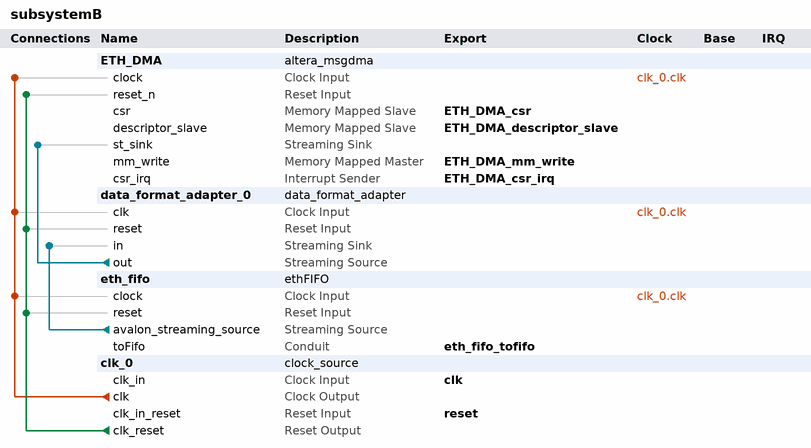
[diagram p0: system contents]
# Platform Designer (Qsys) system subsystemB, Stratix IV EP4SGX230KF40C2
# Parameters at their usual value, and those the tool derives, are not listed.
package require -exact qsys 18.1
create_system subsystemB
set_project_property DEVICE_FAMILY {Stratix IV}
set_project_property DEVICE EP4SGX230KF40C2

add_instance ETH_DMA altera_msgdma 18.1
set_instance_parameter_value ETH_DMA BURST_ENABLE 0
set_instance_parameter_value ETH_DMA DATA_FIFO_DEPTH 64
set_instance_parameter_value ETH_DMA DATA_WIDTH 256
set_instance_parameter_value ETH_DMA DESCRIPTOR_FIFO_DEPTH 128
set_instance_parameter_value ETH_DMA ENHANCED_FEATURES 0
set_instance_parameter_value ETH_DMA ERROR_ENABLE 0
set_instance_parameter_value ETH_DMA MAX_BURST_COUNT 2
set_instance_parameter_value ETH_DMA MAX_BYTE 2048
set_instance_parameter_value ETH_DMA MODE 2
set_instance_parameter_value ETH_DMA PACKET_ENABLE 1
set_instance_parameter_value ETH_DMA TRANSFER_TYPE {Aligned Accesses}

add_instance data_format_adapter_0 data_format_adapter 18.1
set_instance_parameter_value data_format_adapter_0 inBitsPerSymbol 8
set_instance_parameter_value data_format_adapter_0 inChannelWidth 0
set_instance_parameter_value data_format_adapter_0 inErrorWidth 0
set_instance_parameter_value data_format_adapter_0 inMaxChannel 0
set_instance_parameter_value data_format_adapter_0 inReadyLatency 0
set_instance_parameter_value data_format_adapter_0 inSymbolsPerBeat 8
set_instance_parameter_value data_format_adapter_0 inUseEmpty false
set_instance_parameter_value data_format_adapter_0 inUseEmptyPort AUTO
set_instance_parameter_value data_format_adapter_0 inUsePackets true
set_instance_parameter_value data_format_adapter_0 outSymbolsPerBeat 32
set_instance_parameter_value data_format_adapter_0 outUseEmpty false
set_instance_parameter_value data_format_adapter_0 outUseEmptyPort AUTO

add_instance eth_fifo ethFIFO 1.0

add_instance clk_0 clock_source 18.1
set_instance_parameter_value clk_0 clockFrequency 200000000

# connections
add_connection clk_0.clk data_format_adapter_0.clk clock
add_connection clk_0.clk ETH_DMA.clock clock
add_connection clk_0.clk eth_fifo.clock clock
add_connection clk_0.clk_reset data_format_adapter_0.reset reset
add_connection clk_0.clk_reset ETH_DMA.reset_n reset
add_connection clk_0.clk_reset eth_fifo.reset reset
add_connection data_format_adapter_0.out ETH_DMA.st_sink avalon_streaming
add_connection eth_fifo.avalon_streaming_source data_format_adapter_0.in avalon_streaming

# exported interfaces
add_interface ETH_DMA_csr avalon slave
set_interface_property ETH_DMA_csr EXPORT_OF ETH_DMA.csr
add_interface ETH_DMA_csr_irq interrupt sender
set_interface_property ETH_DMA_csr_irq EXPORT_OF ETH_DMA.csr_irq
add_interface ETH_DMA_descriptor_slave avalon slave
set_interface_property ETH_DMA_descriptor_slave EXPORT_OF ETH_DMA.descriptor_slave
add_interface ETH_DMA_mm_write avalon master
set_interface_property ETH_DMA_mm_write EXPORT_OF ETH_DMA.mm_write
add_interface clk clock sink
set_interface_property clk EXPORT_OF clk_0.clk_in
add_interface eth_fifo_tofifo conduit end
set_interface_property eth_fifo_tofifo EXPORT_OF eth_fifo.toFifo
add_interface reset reset sink
set_interface_property reset EXPORT_OF clk_0.clk_in_reset

set_interconnect_requirement {$system} qsys_mm.clockCrossingAdapter HANDSHAKE
set_interconnect_requirement {$system} qsys_mm.enableEccProtection FALSE
set_interconnect_requirement {$system} qsys_mm.insertDefaultSlave FALSE
set_interconnect_requirement {$system} qsys_mm.maxAdditionalLatency 1

save_system subsystemB.qsys
